# EAGLE design Newmark_Controller (EAGLE 9.4.2)
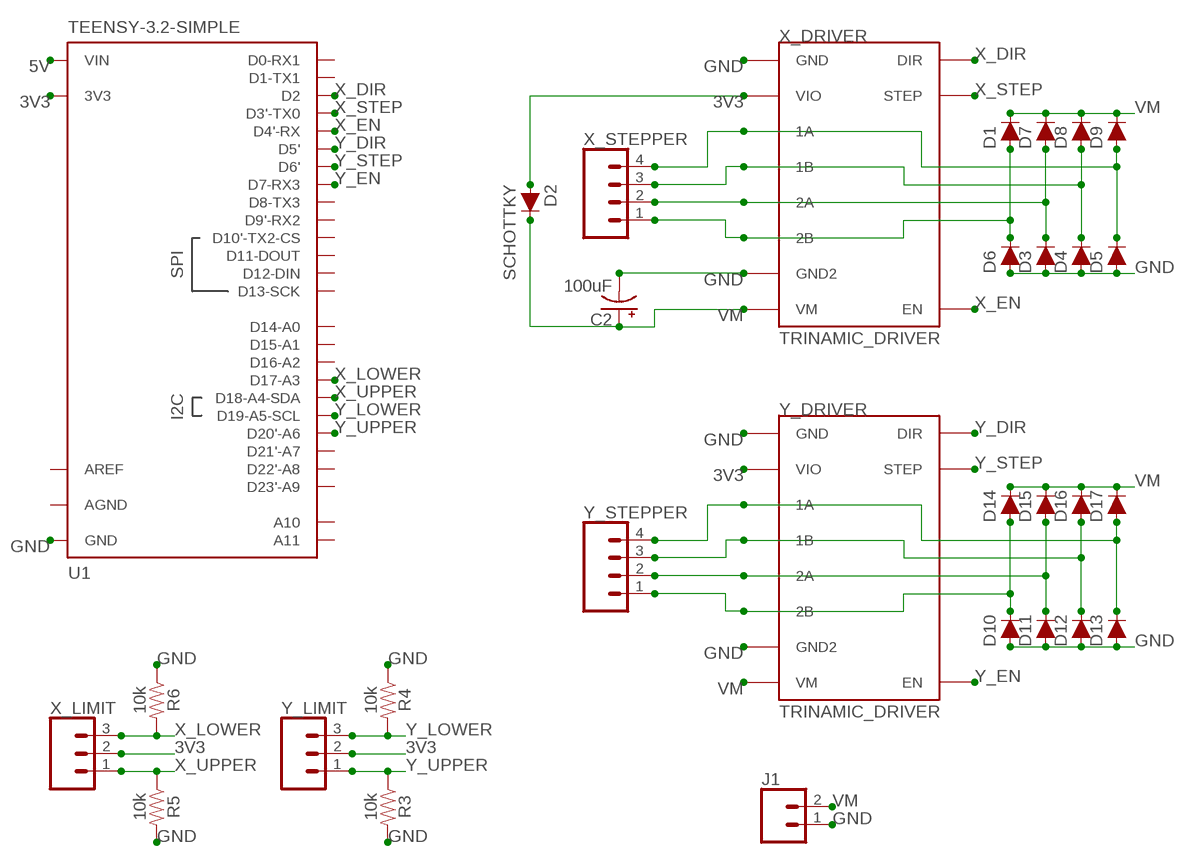
[diagram p0: schematic, sheet 1]

## Parts
C2  100uF  100UF-POLAR-RADIAL-2.5MM-25V-20%  [CPOL-RADIAL-2.5MM-6.5MM]
D1  DIODE-1N4148  [DIODE-1N4148]
D2  SCHOTTKY  DIODE-1N4148  [DIODE-1N4148]
D3  DIODE-1N4148  [DIODE-1N4148]
D4  DIODE-1N4148  [DIODE-1N4148]
D5  DIODE-1N4148  [DIODE-1N4148]
D6  DIODE-1N4148  [DIODE-1N4148]
D7  DIODE-1N4148  [DIODE-1N4148]
D8  DIODE-1N4148  [DIODE-1N4148]
D9  DIODE-1N4148  [DIODE-1N4148]
D10  DIODE-1N4148  [DIODE-1N4148]
D11  DIODE-1N4148  [DIODE-1N4148]
D12  DIODE-1N4148  [DIODE-1N4148]
D13  DIODE-1N4148  [DIODE-1N4148]
D14  DIODE-1N4148  [DIODE-1N4148]
D15  DIODE-1N4148  [DIODE-1N4148]
D16  DIODE-1N4148  [DIODE-1N4148]
D17  DIODE-1N4148  [DIODE-1N4148]
J1  CONN_023.5MM  [SCREWTERMINAL-3.5MM-2]
R3  10k  10KOHM-HORIZ-1/6W-5%  [AXIAL-0.3]
R4  10k  10KOHM-HORIZ-1/6W-5%  [AXIAL-0.3]
R5  10k  10KOHM-HORIZ-1/6W-5%  [AXIAL-0.3]
R6  10k  10KOHM-HORIZ-1/6W-5%  [AXIAL-0.3]
U1  TEENSY-3.2-SIMPLE  [TEENSY-3.2-SIMPLE]
X_DRIVER  TRINAMIC_DRIVER  [TRINAMIC_DRIVER]
X_LIMIT  CONN_03  [1X03]
X_STEPPER  CONN_04PTH  [1X04]
Y_DRIVER  TRINAMIC_DRIVER  [TRINAMIC_DRIVER]
Y_LIMIT  CONN_03  [1X03]
Y_STEPPER  CONN_04PTH  [1X04]

## Nets
3V3: D2.A U1.3.3V(3V3) X_DRIVER.5V(VIO) X_LIMIT.2 Y_DRIVER.5V(VIO) Y_LIMIT.2
5V: U1.VIN
GND: C2.2(-) D3.A D4.A D5.A D6.A D10.A D11.A D12.A D13.A J1.1 R3.P$2 R4.P$1 R5.P$2 R6.P$1 U1.GND X_DRIVER.GND X_DRIVER.GND2 Y_DRIVER.GND Y_DRIVER.GND2
N$10: D5.C D9.A X_DRIVER.1A X_STEPPER.4
N$11: D4.C D8.A X_DRIVER.1B X_STEPPER.3
N$12: D3.C D7.A X_DRIVER.2A X_STEPPER.2
N$13: D1.A D6.C X_DRIVER.2B X_STEPPER.1
N$18: D13.C D17.A Y_DRIVER.1A Y_STEPPER.4
N$19: D12.C D16.A Y_DRIVER.1B Y_STEPPER.3
N$20: D11.C D15.A Y_DRIVER.2A Y_STEPPER.2
N$21: D10.C D14.A Y_DRIVER.2B Y_STEPPER.1
VM: C2.1(+) D1.C D2.C D7.C D8.C D9.C D14.C D15.C D16.C D17.C J1.2 X_DRIVER.VM Y_DRIVER.VM
X_DIR: U1.2(D2) X_DRIVER.DIR
X_EN: U1.4(D4'-RX) X_DRIVER.EN
X_LOWER: R6.P$2 U1.17(D17-A3) X_LIMIT.3
X_STEP: U1.3(D3'-TX0) X_DRIVER.STEP
X_UPPER: R5.P$1 U1.18(D18-A4-SDA) X_LIMIT.1
Y_DIR: U1.5(D5') Y_DRIVER.DIR
Y_EN: U1.7(D7-RX3) Y_DRIVER.EN
Y_LOWER: R4.P$2 U1.19(D19-A5-SCL) Y_LIMIT.3
Y_STEP: U1.6(D6') Y_DRIVER.STEP
Y_UPPER: R3.P$1 U1.20(D20'-A6) Y_LIMIT.1
Unconnected: U1.0(D0-RX1) U1.1(D1-TX1) U1.8(D8-TX3) U1.9(D9'-RX2) U1.10(D10'-TX2-CS) U1.11(D11-DOUT) U1.12(D12-DIN) U1.13(D13-SCK) U1.14(D14-A0) U1.15(D15-A1) U1.16(D16-A2) U1.21(D21'-A7) U1.22(D22'-A8) U1.23(D23'-A9) U1.A10 U1.A11

## Power pins joined to a net without a drawn wire
AGND: U1.AGND
AREF: U1.AREF

## Library data of the parts
C2 = SparkFun-Capacitors:100UF-POLAR: 100µF polarized capacitors A capacitor is a passive two-terminal electrical component used to store electrical energy temporarily in an electric field.; PROD_ID: CAP-08439
D1-D17 = SparkFun-DiscreteSemi:DIODE: Diode These are standard reverse protection diodes and small signal diodes. SparkFun Products: SparkFun SparkPunk Sound Kit <https://www.sparkfun.com/products/11177> SparkFun ESP8266 Thing <https://www.sparkfun.com/products/13231>; PROD_ID: DIO-08378; VALUE: 200mA/100V/1V
J1 = SparkFun-Connectors:CONN_02: Multi connection point. Often used as Generic Header-pin footprint for 0.1 inch spaced/style header connections On any of the 0.1 inch spaced packages, you can populate with these: Break Away Headers - Straight <https://www.sparkfun.com/products/116> (PRT-00116) Break Away Male Headers - Right Angle <https://www.sparkfun.com/products/553> (PRT-00553) Female Headers <https://www.sparkfun.com/products/115> (PRT-00115) Break Away Headers - Machine Pin <https://www.sparkfun.com/products/117> (PRT-00117) Break Away Female Headers - Swiss Machine Pin <https://www.sparkfun.com/products/743> (PRT-00743) For SCREWTERMINALS and SPRING TERMINALS visit here: Screw Terimnals on SparkFun.com <https://www.sparkfun.com/search/results?term=Screw+Terminals> (5mm/3.5mm/2.54mm spacing) This device is also useful as a general connection point to wire up your design to another part of your project. Our various solder wires solder well into these plated through hole pads. Hook-Up Wire - Assortment (Stranded, 22 AWG) <https://www.sparkfun.com/products/11375> (PRT-11375) Hook-Up Wire - Assortment (Solid Core, 22 AWG) <https://www.sparkfun.com/products/11367> (PRT-11367) View the entire wire category on our website here <https://www.sparkfun.com/categories/141> Special notes: Molex polarized connector foot print use with: PRT-08233 with associated crimp pins and housings. 2.54_SCREWTERM for use with PRT-10571. 3.5mm Screw Terminal footprints for PRT-08084 5mm Screw Terminal footprints for use with PRT-08432; PROD_ID: CONN-08399
R3-R6 = SparkFun-Resistors:10KOHM: 10kΩ resistor A resistor is a passive two-terminal electrical component that implements electrical resistance as a circuit element. Resistors act to reduce current flow, and, at the same time, act to lower voltage levels within circuits. - Wikipedia; PROD_ID: RES-08375
U1 = nordin-pga and filter:TEENSY-3.2-SIMPLE
X_DRIVER Y_DRIVER = My Library:TRINAMIC_DRIVER
X_LIMIT Y_LIMIT = SparkFun-Connectors:CONN_03: Multi connection point. Often used as Generic Header-pin footprint for 0.1 inch spaced/style header connections On any of the 0.1 inch spaced packages, you can populate with these: Break Away Headers - Straight <https://www.sparkfun.com/products/116> (PRT-00116) Break Away Male Headers - Right Angle <https://www.sparkfun.com/products/553> (PRT-00553) Female Headers <https://www.sparkfun.com/products/115> (PRT-00115) Break Away Headers - Machine Pin <https://www.sparkfun.com/products/117> (PRT-00117) Break Away Female Headers - Swiss Machine Pin <https://www.sparkfun.com/products/743> (PRT-00743) Stackable Header - 3 Pin (Female, 0.1") <https://www.sparkfun.com/products/13875> (PRT-13875) For SCREWTERMINALS and SPRING TERMINALS visit here: Screw Terimnals on SparkFun.com <https://www.sparkfun.com/search/results?term=Screw+Terminals> (5mm/3.5mm/2.54mm spacing) This device is also useful as a general connection point to wire up your design to another part of your project. Our various solder wires solder well into these plated through hole pads. Hook-Up Wire - Assortment (Stranded, 22 AWG) <https://www.sparkfun.com/products/11375> (PRT-11375) Hook-Up Wire - Assortment (Solid Core, 22 AWG) <https://www.sparkfun.com/products/11367> (PRT-11367) View the entire wire category on our website here <https://www.sparkfun.com/categories/141> Special notes: Molex polarized connector foot print use with SKU : PRT-08232 with associated crimp pins and housings.; PROD_ID: XXX-00000; VALUE: 455-1750-1-ND
X_STEPPER Y_STEPPER = SparkFun-Connectors:CONN_04: Multi connection point. Often used as Generic Header-pin footprint for 0.1 inch spaced/style header connections On any of the 0.1 inch spaced packages, you can populate with these: Break Away Headers - Straight <https://www.sparkfun.com/products/116> (PRT-00116) Break Away Male Headers - Right Angle <https://www.sparkfun.com/products/553> (PRT-00553) Female Headers <https://www.sparkfun.com/products/115> (PRT-00115) Break Away Headers - Machine Pin <https://www.sparkfun.com/products/117> (PRT-00117) Break Away Female Headers - Swiss Machine Pin <https://www.sparkfun.com/products/743> (PRT-00743) For SCREWTERMINALS and SPRING TERMINALS visit here: Screw Terimnals on SparkFun.com <https://www.sparkfun.com/search/results?term=Screw+Terminals> (5mm/3.5mm/2.54mm spacing) This device is also useful as a general connection point to wire up your design to another part of your project. Our various solder wires solder well into these plated through hole pads. Hook-Up Wire - Assortment (Stranded, 22 AWG) <https://www.sparkfun.com/products/11375> (PRT-11375) Hook-Up Wire - Assortment (Solid Core, 22 AWG) <https://www.sparkfun.com/products/11367> (PRT-11367) View the entire wire category on our website here <https://www.sparkfun.com/categories/141> Special notes: Molex polarized connector foot print use with SKU : PRT-08231 with associated crimp pins and housings. 1MM SMD Version SKU: PRT-10208; PROD_ID: CONN-09696

## Board
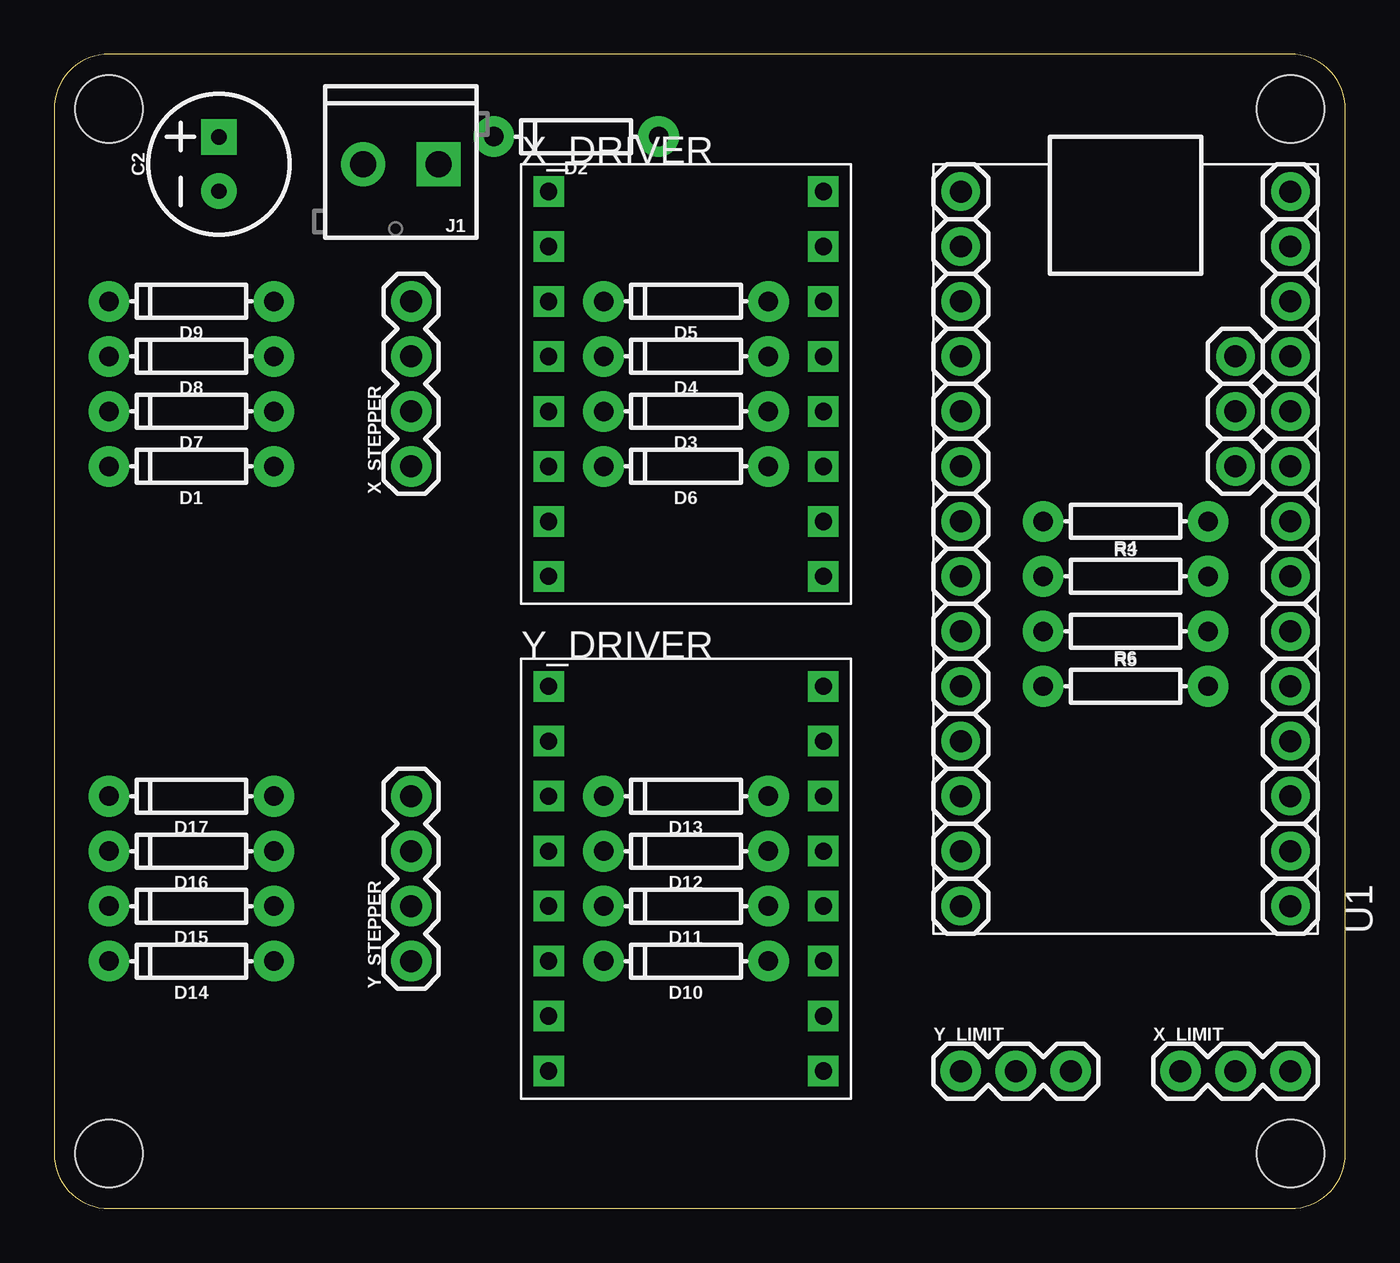
[diagram p1: board, top side]
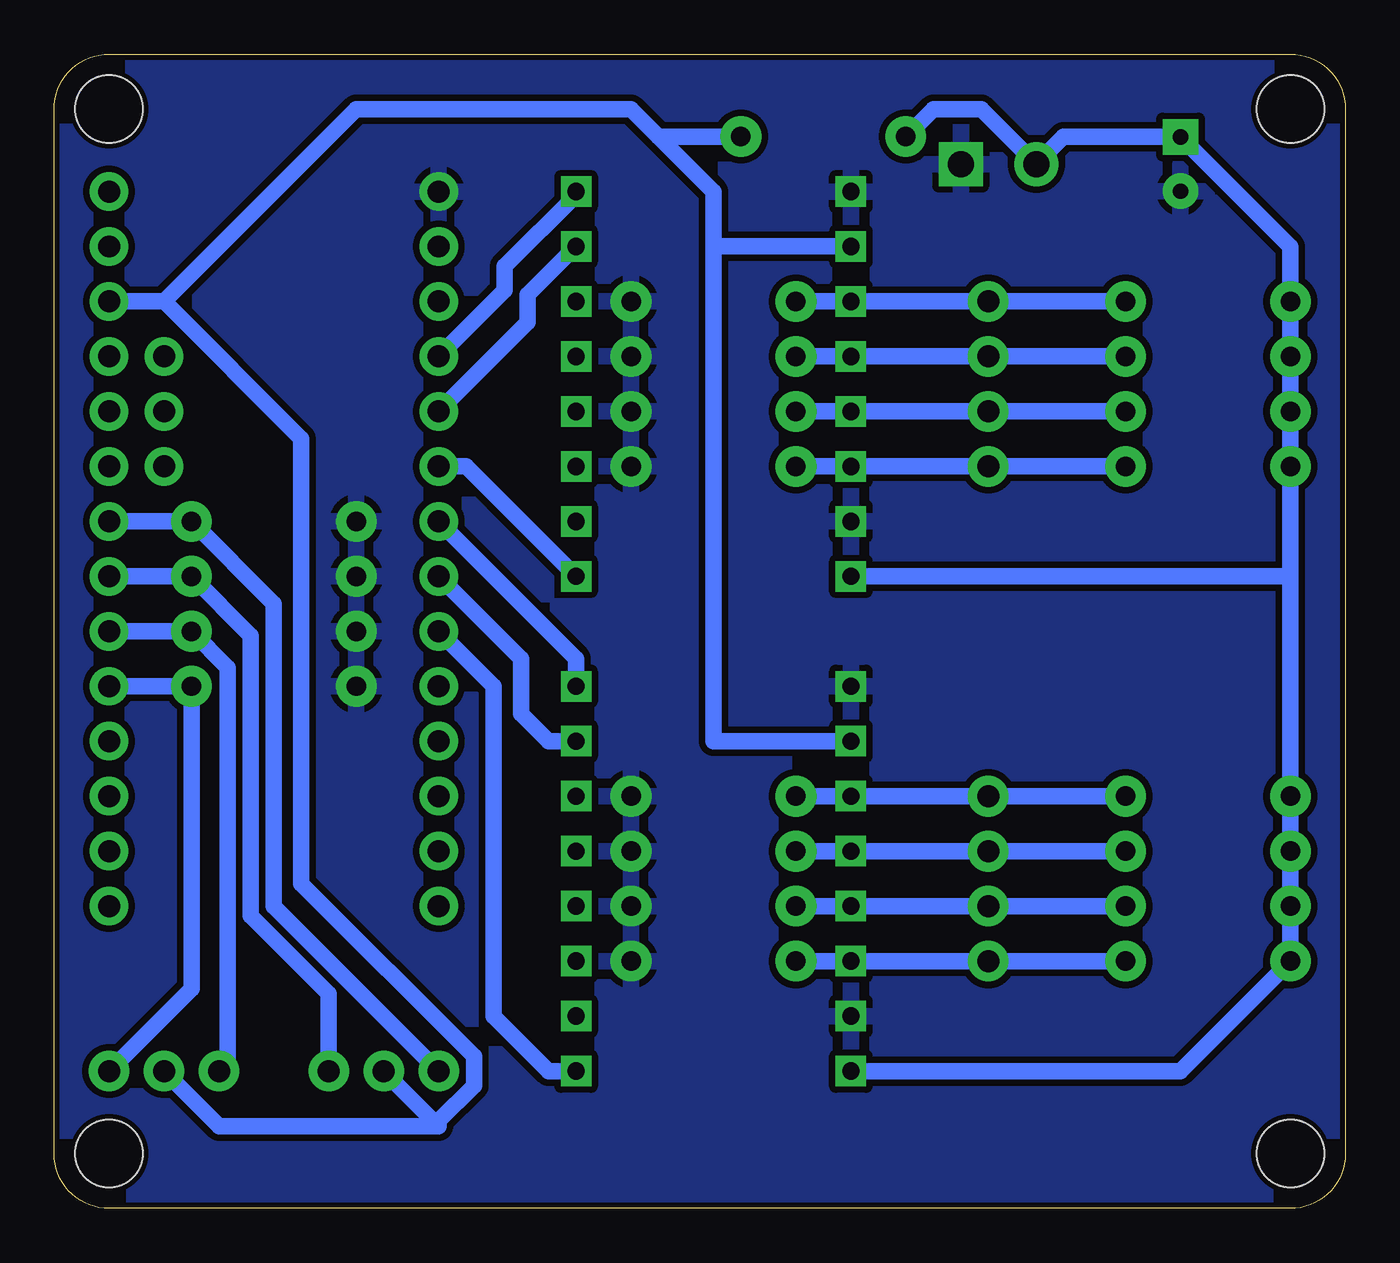
[diagram p2: board, bottom side, seen from below]

Size 59.69 x 53.34 mm. Coordinates in mm from the lower left corner, seen from the top.
Outline: 0,50.8 0,2.54 arc90 2.54,0 57.15,0 arc90 59.69,2.54 59.69,50.8 arc90 57.15,53.34 2.54,53.34 arc90 0,50.8
Copper layers (1*16): Top 0.035mm / dielectric 1.5mm / Bottom 0.035mm
Design rules "ECENshop": minimum track width 10mil, minimum drill 0.3mm, track to track 12mil, track to pad 12mil, pad to pad 12mil, via to via 12mil, smd to smd 12mil, copper to edge 10mil, drill to drill 0.3mm, minimum pad ring 12mil, minimum via ring 12mil, stop-mask expansion 3mil, vias tented up to drill 25mil, thermal gap 12mil
Holes 3.1 mm at 2.54,50.8 57.15,50.8 2.54,2.54 57.15,2.54

### Footprints (pad centres in the part's own frame; a part is rotated, then mirrored left to right if it is on the bottom)
CPOL-RADIAL-2.5MM-6.5MM = drill 0.7 pad 1.651 square: 1 1.25,0 | drill 0.7 pad 1.651: 2 -1.25,0
DIODE-1N4148 = drill 0.9 pad 1.88: A -3.81,0; C 3.81,0
SCREWTERMINAL-3.5MM-2 = drill 1.2 pad 2.032 square: 1 0,0 | drill 1.2 pad 2.032: 2 3.5,0
AXIAL-0.3 = drill 0.9 pad 1.88: P$1 -3.81,0; P$2 3.81,0
TEENSY-3.2-SIMPLE = drill 1.016 pad 1.778: 0 -7.62,13.97; 1 -7.62,11.43; 2 -7.62,8.89; 3 -7.62,6.35; 3.3V 7.62,11.43; 4 -7.62,3.81; 5 -7.62,1.27; 6 -7.62,-1.27; 7 -7.62,-3.81; 8 -7.62,-6.35; 9 -7.62,-8.89; 10 -7.62,-11.43; 11 -7.62,-13.97; 12 -7.62,-16.51; 13 7.62,-16.51; 14 7.62,-13.97; 15 7.62,-11.43; 16 7.62,-8.89; 17 7.62,-6.35; 18 7.62,-3.81; 19 7.62,-1.27; 20 7.62,1.27; 21 7.62,3.81; 22 7.62,6.35; 23 7.62,8.89; A10 5.08,6.35; A11 5.08,3.81; AGND 7.62,13.97; AREF 5.08,8.89; GND -7.62,16.51; VIN 7.62,16.51
TRINAMIC_DRIVER = drill 0.8 square: 1A 1.27,13.97; 1B 1.27,11.43; 2A 1.27,8.89; 2B 1.27,6.35; 5V 1.27,16.51; DIR 13.97,19.05; EN 13.97,1.27; GND 1.27,3.81; GND2 1.27,19.05; P$10 13.97,3.81; P$11 13.97,6.35; P$12 13.97,8.89; P$13 13.97,11.43; P$14 13.97,13.97; STEP 13.97,16.51; VM 1.27,1.27
1X03 = drill 1.016 pad 1.88: 1 0,0; 2 2.54,0; 3 5.08,0
1X04 = drill 1.016 pad 1.88: 1 0,0; 2 2.54,0; 3 5.08,0; 4 7.62,0

### Placement (x,y rotation side)
C2  7.62,48.26 90 top
D1  6.35,34.29 180 top
D2  24.13,49.53 180 top
D3  29.21,36.83 180 top
D4  29.21,39.37 180 top
D5  29.21,41.91 180 top
D6  29.21,34.29 180 top
D7  6.35,36.83 180 top
D8  6.35,39.37 180 top
D9  6.35,41.91 180 top
D10  29.21,11.43 180 top
D11  29.21,13.97 180 top
D12  29.21,16.51 180 top
D13  29.21,19.05 180 top
D14  6.35,11.43 180 top
D15  6.35,13.97 180 top
D16  6.35,16.51 180 top
D17  6.35,19.05 180 top
J1  17.78,48.26 180 top
R3  49.53,31.75 180 top
R4  49.53,29.21 0 top
R5  49.53,26.67 180 top
R6  49.53,24.13 0 top
U1  49.53,30.48 0 top
X_DRIVER  21.59,27.94 0 top
X_LIMIT  52.07,6.35 0 top
X_STEPPER  16.51,34.29 90 top
Y_DRIVER  21.59,5.08 0 top
Y_LIMIT  41.91,6.35 0 top
Y_STEPPER  16.51,11.43 90 top

### Tracks (layer width: path | path; a pad name or v marks a point on that pad's centre or on a via)
3V3
  Bottom 0.762: U1.3.3V 54.61,41.91 | X_DRIVER.5V 29.21,44.45 | 29.21,44.45 29.21,46.99 31.75,49.53 | 31.75,49.53 33.02,50.8 45.72,50.8 54.61,41.91 | 29.21,44.45 29.21,21.59 Y_DRIVER.5V | D2.A 31.75,49.53 | 41.91,3.81 Y_LIMIT.2 | 41.91,3.81 52.07,3.81 X_LIMIT.2 | 54.61,41.91 48.26,35.56 48.26,15 40.28,7.02 40.28,5.68 41.91,4.05 41.91,3.81
GND
  pour Bottom: -3.81,-3.81 -3.81,54.61 62.23,54.61 62.23,-3.81
N$10
  Bottom 0.762: D5.C X_DRIVER.1A X_STEPPER.4 D9.A
N$11
  Bottom 0.762: D4.C X_DRIVER.1B X_STEPPER.3 D8.A
N$12
  Bottom 0.762: D7.A X_STEPPER.2 X_DRIVER.2A D3.C
N$13
  Bottom 0.762: D6.C X_DRIVER.2B X_STEPPER.1 D1.A
N$18
  Bottom 0.762: D17.A Y_STEPPER.4 Y_DRIVER.1A D13.C
N$19
  Bottom 0.762: D16.A Y_STEPPER.3 Y_DRIVER.1B D12.C
N$20
  Bottom 0.762: D15.A Y_STEPPER.2 Y_DRIVER.2A D11.C
N$21
  Bottom 0.762: D14.A Y_STEPPER.1 Y_DRIVER.2B D10.C
VM
  Bottom 0.762: 2.54,29.21 X_DRIVER.VM | 2.54,29.21 D1.C D7.C D8.C D9.C 2.54,44.43 C2.1 13.03,49.51 J1.2 16.82,50.8 19.05,50.8 D2.C | 2.54,29.21 D17.C D16.C D15.C D14.C 7.62,6.35 Y_DRIVER.VM
X_DIR
  Bottom 0.762: X_DRIVER.DIR 35.56,46.83 38.86,43.53 38.86,42.42 U1.2
X_EN
  Bottom 0.762: X_DRIVER.EN 40.64,34.29 U1.4
X_LOWER
  Bottom 0.762: U1.17 R6.P$2 53.34,10.16 X_LIMIT.3
X_STEP
  Bottom 0.762: X_DRIVER.STEP 37.8,42.22 37.8,40.95 U1.3
X_UPPER
  Bottom 0.762: U1.18 R5.P$1 51.66,24.99 51.66,6.76 X_LIMIT.1
Y_DIR
  Bottom 0.762: Y_DRIVER.DIR 35.56,25.4 U1.5
Y_EN
  Bottom 0.762: U1.7 39.37,24.13 39.37,8.89 36.83,6.35 Y_DRIVER.EN
Y_LOWER
  Bottom 0.762: U1.19 R4.P$2 50.6,26.47 50.6,13.53 46.99,9.92 Y_LIMIT.3
Y_STEP
  Bottom 0.762: U1.6 38.1,25.4 38.1,22.86 36.83,21.59 Y_DRIVER.STEP
Y_UPPER
  Bottom 0.762: U1.20 R3.P$1 49.53,27.94 49.53,13.97 Y_LIMIT.1